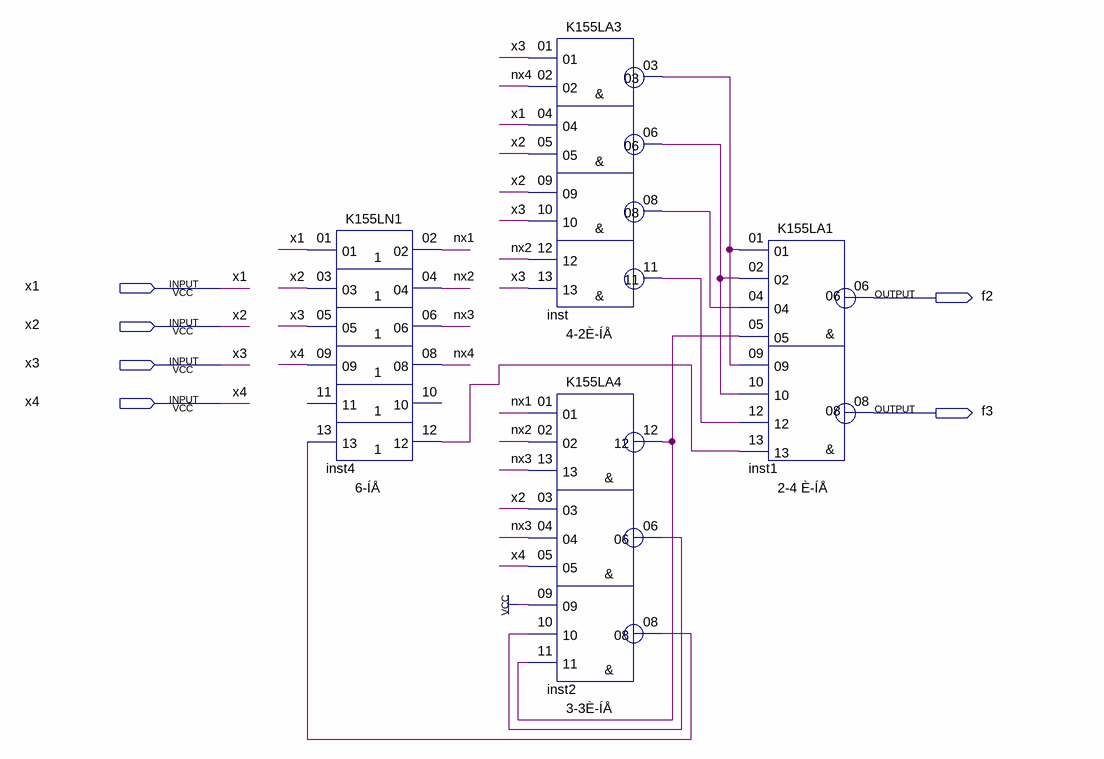
[diagram p0: schematic sheet]
// Quartus schematic lab1_scheme2.bdf as structural Verilog: 4 symbols, 6 pins
module lab1_scheme2 (
  input  x1,
  input  x2,
  input  x3,
  input  x4,
  output f2,
  output f3
);

  wire inst2_06, inst2_08, inst2_12, inst4_12, inst_03, inst_06, inst_08, inst_11, nx1, nx2, nx3, nx4;

  K155LN1 inst4 (
    .\01 (x1), .\03 (x2), .\05 (x3), .\09 (x4), .\13 (inst2_08), .\02 (nx1), .\04 (nx2), .\06 (nx3),
    .\08 (nx4), .\12 (inst4_12));  // open: 11, 10
  K155LA3 inst (
    .\01 (x3), .\02 (nx4), .\04 (x1), .\05 (x2), .\09 (x2), .\10 (x3), .\12 (nx2), .\13 (x3), .\03 (inst_03),
    .\06 (inst_06), .\08 (inst_08), .\11 (inst_11));
  K155LA4 inst2 (
    .\01 (nx1), .\02 (nx2), .\13 (nx3), .\03 (x2), .\04 (nx3), .\05 (x4), .\09 (1'b1), .\10 (inst2_06),
    .\11 (inst2_12), .\12 (inst2_12), .\06 (inst2_06), .\08 (inst2_08));
  K155LA1 inst1 (
    .\01 (inst_03), .\02 (inst_06), .\04 (inst_08), .\05 (inst2_12), .\09 (inst_03), .\10 (inst_06),
    .\12 (inst_11), .\13 (inst4_12), .\06 (f2), .\08 (f3));
endmodule
